# EAGLE design DRIVER_L293D (EAGLE 9.0.1)
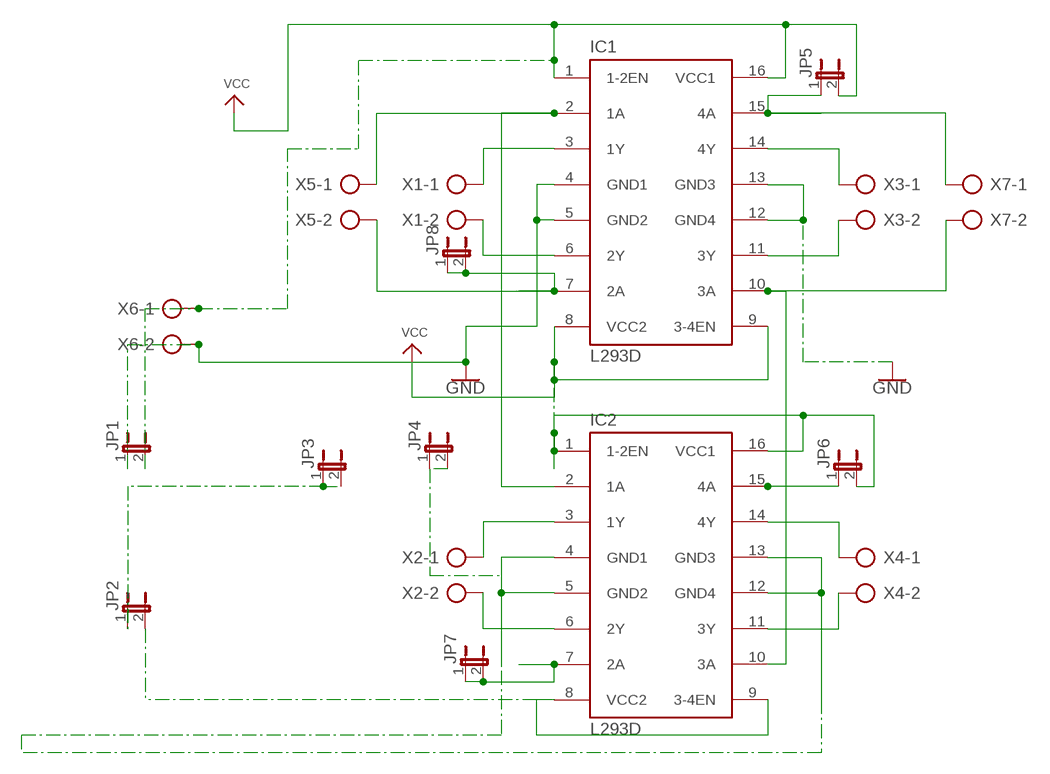
[diagram p0: schematic, sheet 1]

## Parts
IC1  L293D  [DIL16]
IC2  L293D  [DIL16]
JP1  JP1E  [JP1]
JP2  JP1E  [JP1]
JP3  JP1E  [JP1]
JP4  JP1E  [JP1]
JP5  JP1E  [JP1]
JP6  JP1E  [JP1]
JP7  JP1E  [JP1]
JP8  JP1E  [JP1]
X1  AK500/2-H  [AK500/2-H]
X2  AK500/2-H  [AK500/2-H]
X3  AK500/2-H  [AK500/2-H]
X4  AK500/2-H  [AK500/2-H]
X5  AK500/2-H  [AK500/2-H]
X6  AK500/2-H  [AK500/2-H]
X7  AK500/2-H  [AK500/2-H]

## Nets
GND: IC1.4(GND1) IC1.5(GND2) IC1.12(GND4) IC1.13(GND3) JP1.1 X6.2
N$2: IC2.7(2A) JP7.1 JP7.2
N$3: IC1.10(3A) IC2.10(3A) X7.2
N$4: IC1.7(2A) JP8.1 JP8.2 X5.2
N$5: IC1.3(1Y) X1.1
N$6: IC1.6(2Y) X1.2
N$7: IC2.3(1Y) X2.1
N$8: IC2.6(2Y) X2.2
N$9: IC1.11(3Y) X3.2
N$10: IC1.14(4Y) X3.1
N$11: IC2.11(3Y) X4.2
N$12: IC2.14(4Y) X4.1
N$13: IC1.2(1A) IC2.2(1A) X5.1
N$14: IC2.15(4A) JP6.1
N$15: JP2.1 JP3.1 JP3.2
N$17: IC2.8(VCC2) IC2.9(3-4EN) JP2.2
N$18: IC2.4(GND1) IC2.5(GND2) IC2.12(GND4) IC2.13(GND3) JP4.1 JP4.2
N$19: IC1.15(4A) JP5.1 X7.1
VCC: IC1.1(1-2EN) IC1.8(VCC2) IC1.9(3-4EN) IC1.16(VCC1) IC2.1(1-2EN) IC2.16(VCC1) JP1.2 JP5.2 JP6.2 X6.1

## Library data of the parts
IC1 IC2 = st-microelectronics:L293D: PUSH-PULL 4 CHANNEL DRIVER; MPN: L293D; OC_FARNELL: 9589619; OC_NEWARK: 56P8249
JP1-JP8 = jumper:JP1E: JUMPER
X1-X7 = con-ptr500:AK500/2-H: CONNECTOR Aug. 2004 / PTR Meßtechnik: Die Bezeichnung der Serie AK505 wurde geändert. Es handelt sich hierbei um AK500 in horizontaler Ausführung.; OC_FARNELL: unknown; OC_NEWARK: unknown

## Board
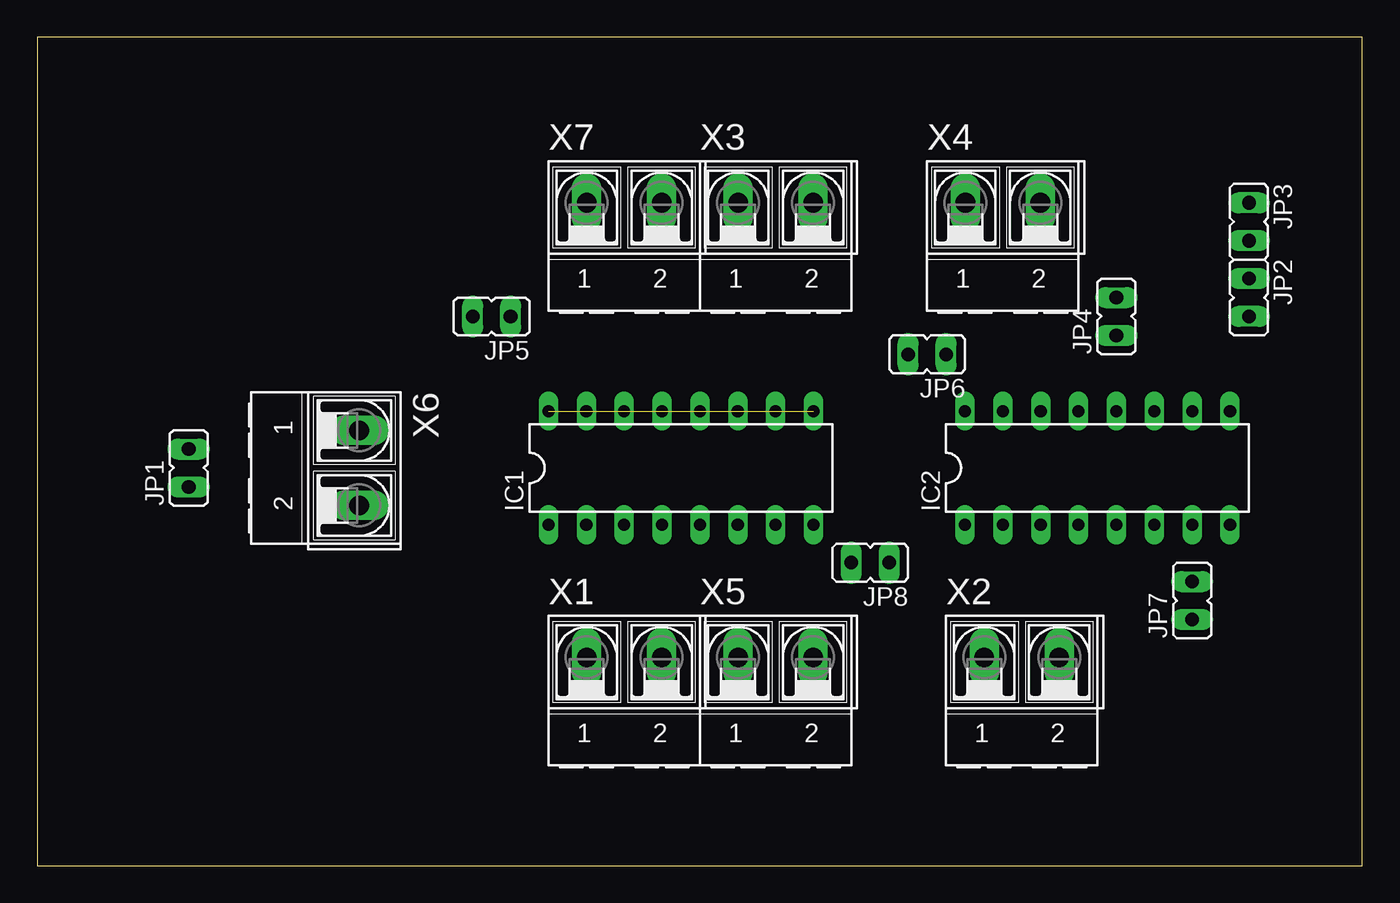
[diagram p1: board, top side]
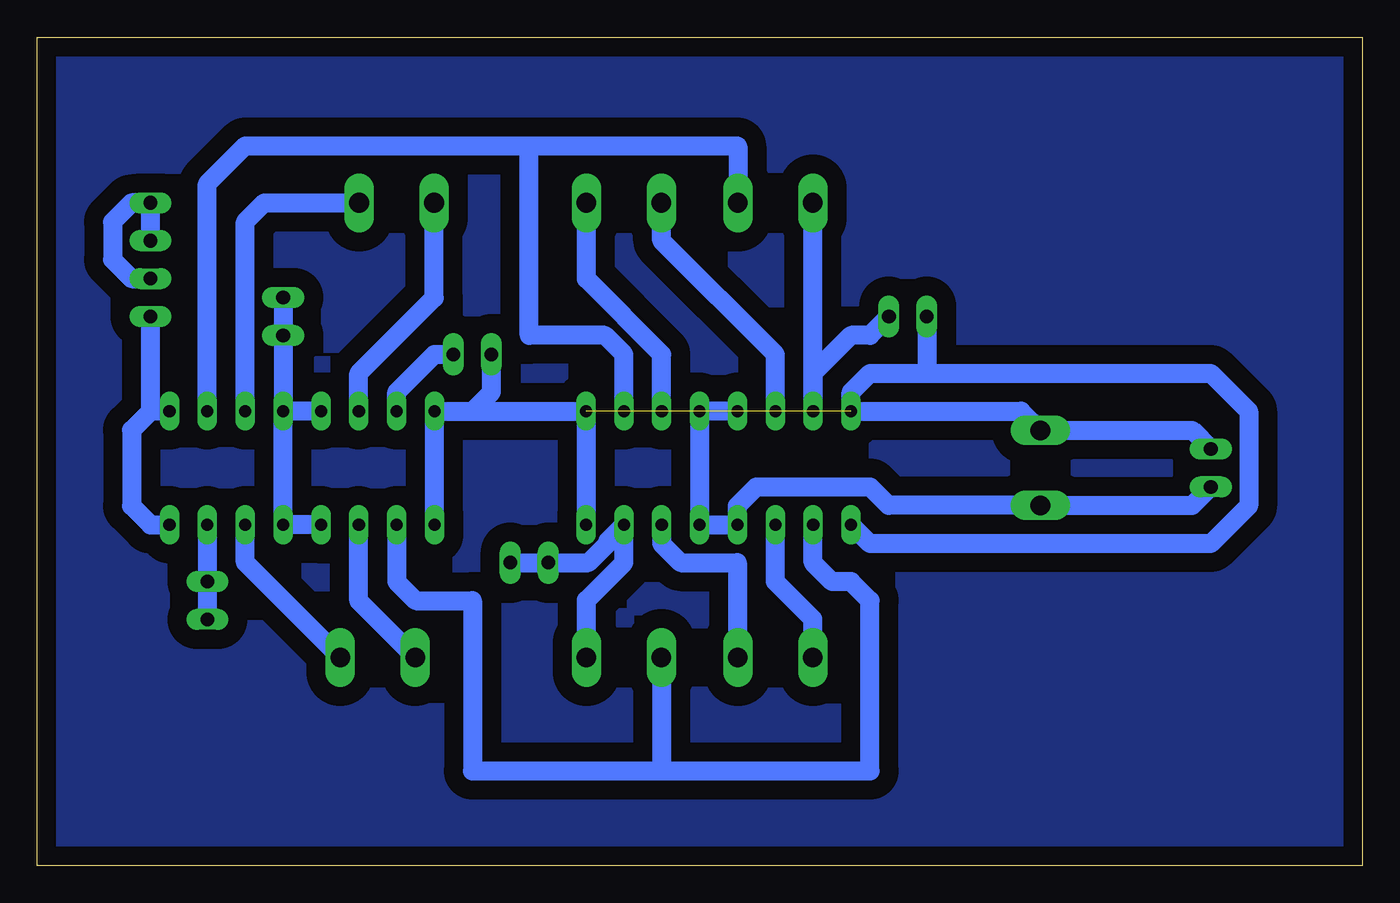
[diagram p2: board, bottom side, seen from below]

Size 88.88 x 55.55 mm. Coordinates in mm from the lower left corner, seen from the top.
Outline: 0,0 88.88,0 88.88,55.55 0,55.55 0,0
Copper layers (1*16): Top 0.035mm / dielectric 1.5mm / Bottom 0.035mm
Design rules "default": minimum track width 6mil, minimum drill 0.35mm, track to track 6mil, track to pad 6mil, pad to pad 6mil, via to via 6mil, smd to smd 6mil, copper to edge 40mil, drill to drill 6mil, minimum pad ring 10mil, minimum via ring 8mil, stop-mask expansion 4mil, vias tented up to drill 0mil, thermal gap 10mil

### Footprints (pad centres in the part's own frame; a part is rotated, then mirrored left to right if it is on the bottom)
DIL16 = drill 0.813 long: 1 -8.89,-3.81; 2 -6.35,-3.81; 3 -3.81,-3.81; 4 -1.27,-3.81; 5 1.27,-3.81; 6 3.81,-3.81; 7 6.35,-3.81; 8 8.89,-3.81; 9 8.89,3.81; 10 6.35,3.81; 11 3.81,3.81; 12 1.27,3.81; 13 -1.27,3.81; 14 -3.81,3.81; 15 -6.35,3.81; 16 -8.89,3.81
JP1 = drill 0.914 long: 1 0,-1.27; 2 0,1.27
AK500/2-H = drill 1.321 long: 1 -2.515,0; 2 2.515,0

### Placement (x,y rotation side)
IC1  43.18,26.67 0 top
IC2  71.12,26.67 0 top
JP1  10.16,26.67 0 top
JP2  81.28,38.1 180 top
JP3  81.28,43.18 180 top
JP4  72.39,36.83 0 top
JP5  30.48,36.83 90 top
JP6  59.69,34.29 90 top
JP7  77.47,17.78 0 top
JP8  55.88,20.32 90 top
X1  39.37,13.97 0 top
X2  66.04,13.97 0 top
X3  49.53,44.45 0 top
X4  64.77,44.45 0 top
X5  49.53,13.97 0 top
X6  21.59,26.67 270 top
X7  39.37,44.45 0 top

### Tracks (layer width: path | path; a pad name or v marks a point on that pad's centre or on a via)
GND
  Bottom 1.27: IC1.13 IC1.12 IC1.5 IC1.4 41.91,24.13 40.64,25.4 33.02,25.4 31.77,24.16 X6.2 11.4,24.16 JP1.1
N$1
  pour Bottom (isolate 1.27): 0,0 0,55.88 88.9,55.88 88.9,0
N$2
  Bottom 1.27: IC2.7 JP7.2 JP7.1
N$3
  Bottom 1.27: IC1.10 49.53,34.29 50.8,35.56 55.88,35.56 55.88,48.26 | 55.88,48.26 41.91,48.26 41.88,48.23 X7.2 | IC2.10 77.47,45.72 74.93,48.26 55.88,48.26
N$4
  Bottom 1.27: X5.2 52.05,17.8 49.53,20.32 IC1.7 50.62,21.77 50.62,21.6 51.9,20.32 JP8.2 JP8.1
N$5
  Bottom 1.27: X1.1 36.85,16.54 39.37,19.05 IC1.3
N$6
  Bottom 1.27: IC1.6 46.99,21.59 45.72,20.32 41.91,20.32 41.91,13.99 X1.2
N$7
  Bottom 1.27: X2.1 67.31,17.75 IC2.3
N$8
  Bottom 1.27: X2.2 74.93,20.34 IC2.6
N$9
  Bottom 1.27: IC1.11 46.99,34.29 52.05,39.34 X3.2
N$10
  Bottom 1.27: IC1.14 39.37,34.29 46.99,41.91 46.99,44.45 X3.1
N$11
  Bottom 1.27: IC2.11 74.93,43.18 73.66,44.45 X4.2
N$12
  Bottom 1.27: IC2.14 67.31,33.02 62.26,38.08 X4.1
N$13
  Bottom 1.27: X5.1 47.02,6.38 | 47.02,6.38 46.99,6.35 33.02,6.35 33.02,17.78 34.29,19.05 35.56,19.05 36.83,20.32 IC1.2 | IC2.2 64.77,19.05 63.5,17.78 59.69,17.78 59.69,6.35 47.04,6.35 47.02,6.38
N$14
  Bottom 1.27: IC2.15 64.77,31.75 62.23,34.29 JP6.1
N$15
  Bottom 1.27: JP3.2 JP3.1 82.55,44.45 83.82,43.18 83.82,40.64 82.55,39.37 JP2.1
N$17
  Bottom 1.27: IC2.9 81.28,30.48 | 81.28,30.48 82.55,29.21 82.55,24.13 81.28,22.86 IC2.8 | 81.28,30.48 JP2.2
N$18
  Bottom 1.27: IC2.13 IC2.12 | JP4.2 JP4.1 IC2.12 | IC2.4 IC2.5 IC2.12
N$19
  Bottom 1.27: X7.1 36.85,45.7 36.83,45.72 IC1.15 36.83,33.02 34.29,35.56 33.02,35.56 JP5.1
VCC  (1 unrouted)
  Bottom 1.27: IC2.1 IC2.16 | IC2.16 IC1.9 IC1.8 | JP1.2 11.4,29.18 X6.1 22.89,30.48 IC1.16 34.29,31.75 33.02,33.02 29.21,33.02 | 29.21,33.02 10.16,33.02 7.62,30.48 7.62,24.13 10.16,21.59 33.02,21.59 IC1.1 | IC2.16 59.69,30.48 58.42,31.75 JP6.2 | JP5.2 29.21,33.02